# Altium project USBtoDB9.PrjPcb
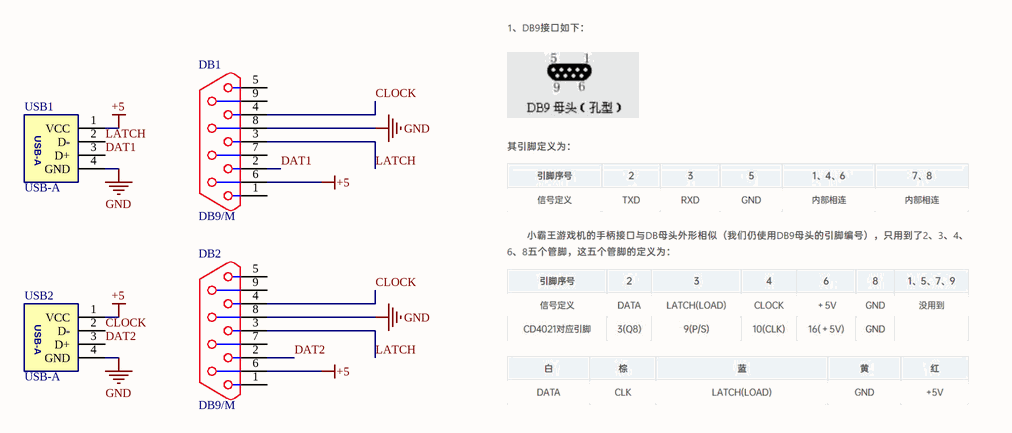
[diagram p0: USB to DB9.SchDoc]
1 sheet, 4 parts. Net scope: global (net labels, ports and power ports of the same name join across sheets).
Board file: USBtoDB9.PcbDoc

## Sheet USB to DB9.SchDoc
size 228 x 127 mm; SheetNumber: 1; SheetTotal: 1

### Parts
DB1  DB9/M  [DB9/M/90]
DB2  DB9/M  [DB9/M/90]
USB1  USB-A  [USB_A/P_A]
USB2  USB-A  [USB_A/P_A]

### Nets
+5: DB1.6 DB2.6 USB1.1(VCC) USB2.1(VCC)
GND: DB1.8 DB2.8 USB1.4(GND) USB2.4(GND)
CLOCK: DB1.4 DB2.4 USB2.2(D-)
DAT1: DB1.2 USB1.3(D+)
DAT2: DB2.2 USB2.3(D+)
LATCH: DB1.3 DB2.3 USB1.2(D-)

Not connected (* = marked no-connect by the designer): DB1 1 5 7 9; DB2 1 5 7 9